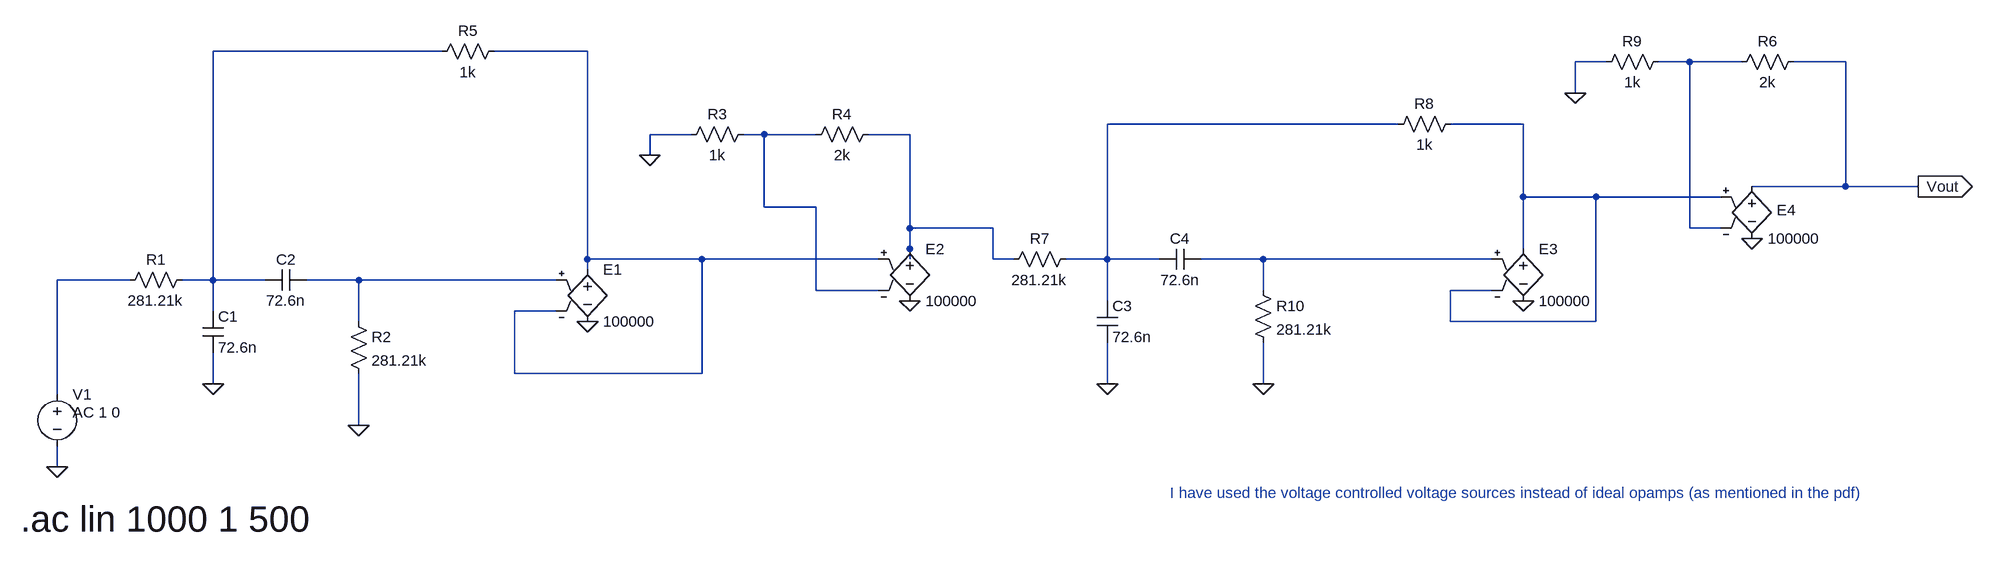
[diagram p0: schematic jahanvi-filter-circuit.asc]
jahanvi-filter-circuit.asc, the LTspice schematic file:
Version 4
SHEET 1 2736 680
WIRE 352 -384 0 -384
WIRE 576 -384 432 -384
WIRE 2144 -368 2096 -368
WIRE 2272 -368 2224 -368
WIRE 2352 -368 2272 -368
WIRE 2512 -368 2432 -368
WIRE 2096 -320 2096 -368
WIRE 1824 -272 1376 -272
WIRE 2016 -272 1904 -272
WIRE 736 -256 672 -256
WIRE 848 -256 816 -256
WIRE 928 -256 848 -256
WIRE 1072 -256 1008 -256
WIRE 672 -224 672 -256
WIRE 2512 -176 2512 -368
WIRE 2512 -176 2368 -176
WIRE 2624 -176 2512 -176
WIRE 2016 -160 2016 -272
WIRE 2128 -160 2016 -160
WIRE 2320 -160 2128 -160
WIRE 848 -144 848 -256
WIRE 928 -144 848 -144
WIRE 1072 -112 1072 -256
WIRE 1200 -112 1072 -112
WIRE 2272 -112 2272 -368
WIRE 2320 -112 2272 -112
WIRE 1072 -80 1072 -112
WIRE 2016 -80 2016 -160
WIRE 576 -64 576 -384
WIRE 752 -64 576 -64
WIRE 1024 -64 752 -64
WIRE 1072 -64 1072 -80
WIRE 1200 -64 1200 -112
WIRE 1232 -64 1200 -64
WIRE 1376 -64 1376 -272
WIRE 1376 -64 1312 -64
WIRE 1456 -64 1376 -64
WIRE 1616 -64 1520 -64
WIRE 1968 -64 1616 -64
WIRE 576 -48 576 -64
WIRE -128 -32 -240 -32
WIRE 0 -32 0 -384
WIRE 0 -32 -48 -32
WIRE 80 -32 0 -32
WIRE 224 -32 144 -32
WIRE 528 -32 224 -32
WIRE 928 -16 928 -144
WIRE 1024 -16 928 -16
WIRE 1616 -16 1616 -64
WIRE 1968 -16 1904 -16
WIRE 1376 0 1376 -64
WIRE 0 16 0 -32
WIRE 528 16 464 16
WIRE 224 32 224 -32
WIRE 1904 32 1904 -16
WIRE 2128 32 2128 -160
WIRE 2128 32 1904 32
WIRE 464 112 464 16
WIRE 752 112 752 -64
WIRE 752 112 464 112
WIRE 0 128 0 80
WIRE 1376 128 1376 64
WIRE 1616 128 1616 64
WIRE -240 144 -240 -32
WIRE 224 192 224 112
WIRE -240 256 -240 224
FLAG -240 256 0
FLAG 1376 128 0
FLAG 1616 128 0
FLAG 2096 -320 0
FLAG 2624 -176 Vout
IOPIN 2624 -176 Out
FLAG 672 -224 0
FLAG 0 128 0
FLAG 224 192 0
FLAG 576 32 0
FLAG 1072 0 0
FLAG 2016 0 0
FLAG 2368 -96 0
SYMBOL res 1328 -80 R90
WINDOW 0 0 56 VBottom 2
WINDOW 3 32 56 VTop 2
SYMATTR InstName R7
SYMATTR Value 281.21k
SYMBOL res 1920 -288 R90
WINDOW 0 0 56 VBottom 2
WINDOW 3 32 56 VTop 2
SYMATTR InstName R8
SYMATTR Value 1k
SYMBOL res 2240 -384 R90
WINDOW 0 0 56 VBottom 2
WINDOW 3 32 56 VTop 2
SYMATTR InstName R9
SYMATTR Value 1k
SYMBOL cap 1360 0 R0
SYMATTR InstName C3
SYMATTR Value 72.6n
SYMBOL cap 1520 -80 R90
WINDOW 0 0 32 VBottom 2
WINDOW 3 32 32 VTop 2
SYMATTR InstName C4
SYMATTR Value 72.6n
SYMBOL res 1600 -32 R0
SYMATTR InstName R10
SYMATTR Value 281.21k
SYMBOL res 2448 -384 R90
WINDOW 0 0 56 VBottom 2
WINDOW 3 32 56 VTop 2
SYMATTR InstName R6
SYMATTR Value 2k
SYMBOL res 832 -272 R90
WINDOW 0 0 56 VBottom 2
WINDOW 3 32 56 VTop 2
SYMATTR InstName R3
SYMATTR Value 1k
SYMBOL res 1024 -272 R90
WINDOW 0 0 56 VBottom 2
WINDOW 3 32 56 VTop 2
SYMATTR InstName R4
SYMATTR Value 2k
SYMBOL res 448 -400 R90
WINDOW 0 0 56 VBottom 2
WINDOW 3 32 56 VTop 2
SYMATTR InstName R5
SYMATTR Value 1k
SYMBOL res -32 -48 R90
WINDOW 0 0 56 VBottom 2
WINDOW 3 32 56 VTop 2
SYMATTR InstName R1
SYMATTR Value 281.21k
SYMBOL res 208 16 R0
SYMATTR InstName R2
SYMATTR Value 281.21k
SYMBOL cap 144 -48 R90
WINDOW 0 0 32 VBottom 2
WINDOW 3 32 32 VTop 2
SYMATTR InstName C2
SYMATTR Value 72.6n
SYMBOL voltage -240 128 R0
WINDOW 3 24 44 Left 2
WINDOW 123 24 44 Left 2
WINDOW 39 0 0 Left 0
SYMATTR Value ""
SYMATTR Value2 AC 1 0
SYMATTR InstName V1
SYMBOL cap -16 16 R0
SYMATTR InstName C1
SYMATTR Value 72.6n
SYMBOL e 576 -64 R0
SYMATTR InstName E1
SYMATTR Value 100000
SYMBOL e 1072 -96 R0
SYMATTR InstName E2
SYMATTR Value 100000
SYMBOL e 2016 -96 R0
SYMATTR InstName E3
SYMATTR Value 100000
SYMBOL e 2368 -192 R0
WINDOW 0 38 52 Left 2
SYMATTR InstName E4
SYMATTR Value 100000
TEXT -296 336 Left 5 !.ac lin 1000 1 500
TEXT 1472 296 Left 2 ;I have used the voltage controlled voltage sources instead of ideal opamps (as mentioned in the pdf)

The netlist it stands for:
* jahanvi-filter-circuit.asc
R7 N004 N007 281.21k
R8 N005 N004 1k
R9 N003 0 1k
C3 N004 0 72.6n
C4 N008 N004 72.6n
R10 N008 0 281.21k
R6 Vout N003 2k
R3 N006 0 1k
R4 N007 N006 2k
R5 N002 N001 1k
R1 N001 N009 281.21k
R2 N010 0 281.21k
C2 N010 N001 72.6n
V1 N009 0 AC 1 0
C1 N001 0 72.6n
E1 N002 0 N010 N002 100000
E2 N007 0 N002 N006 100000
E3 N005 0 N008 N005 100000
E4 Vout 0 N005 N003 100000
.ac lin 1000 1 500
* I have used the voltage controlled voltage sources instead of ideal opamps (as mentioned in the pdf)
.backanno
.end